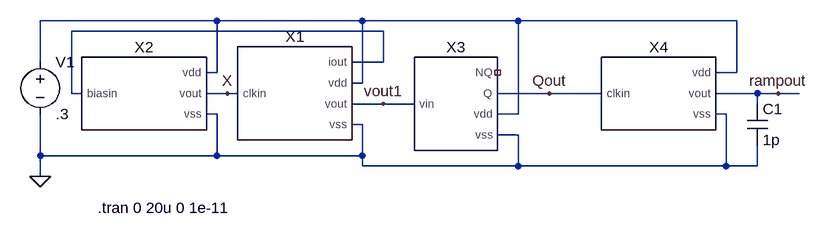
[diagram p0: schematic lowpowersystem1.asc]
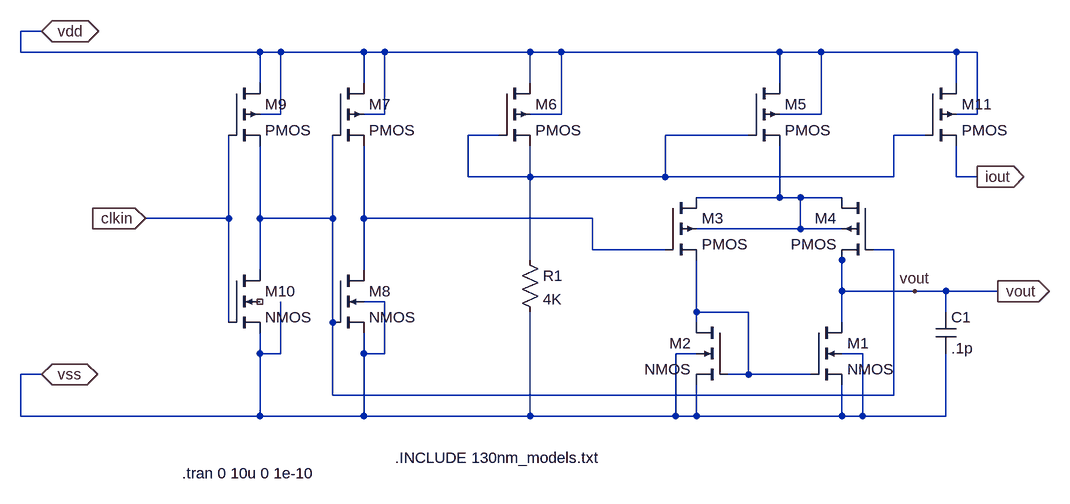
[diagram p1: sub-circuit currentsteeringrampgnerator3sym.asc]
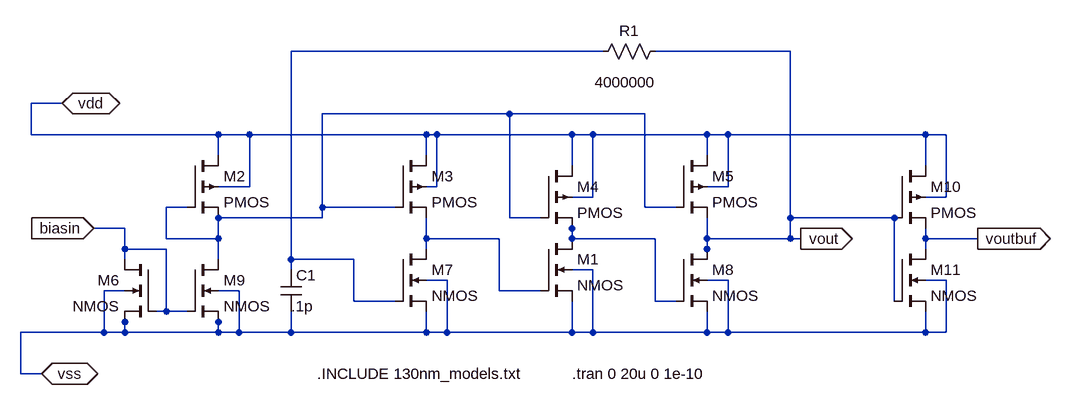
[diagram p2: sub-circuit lphysteresistoscillatorsym5.asc]
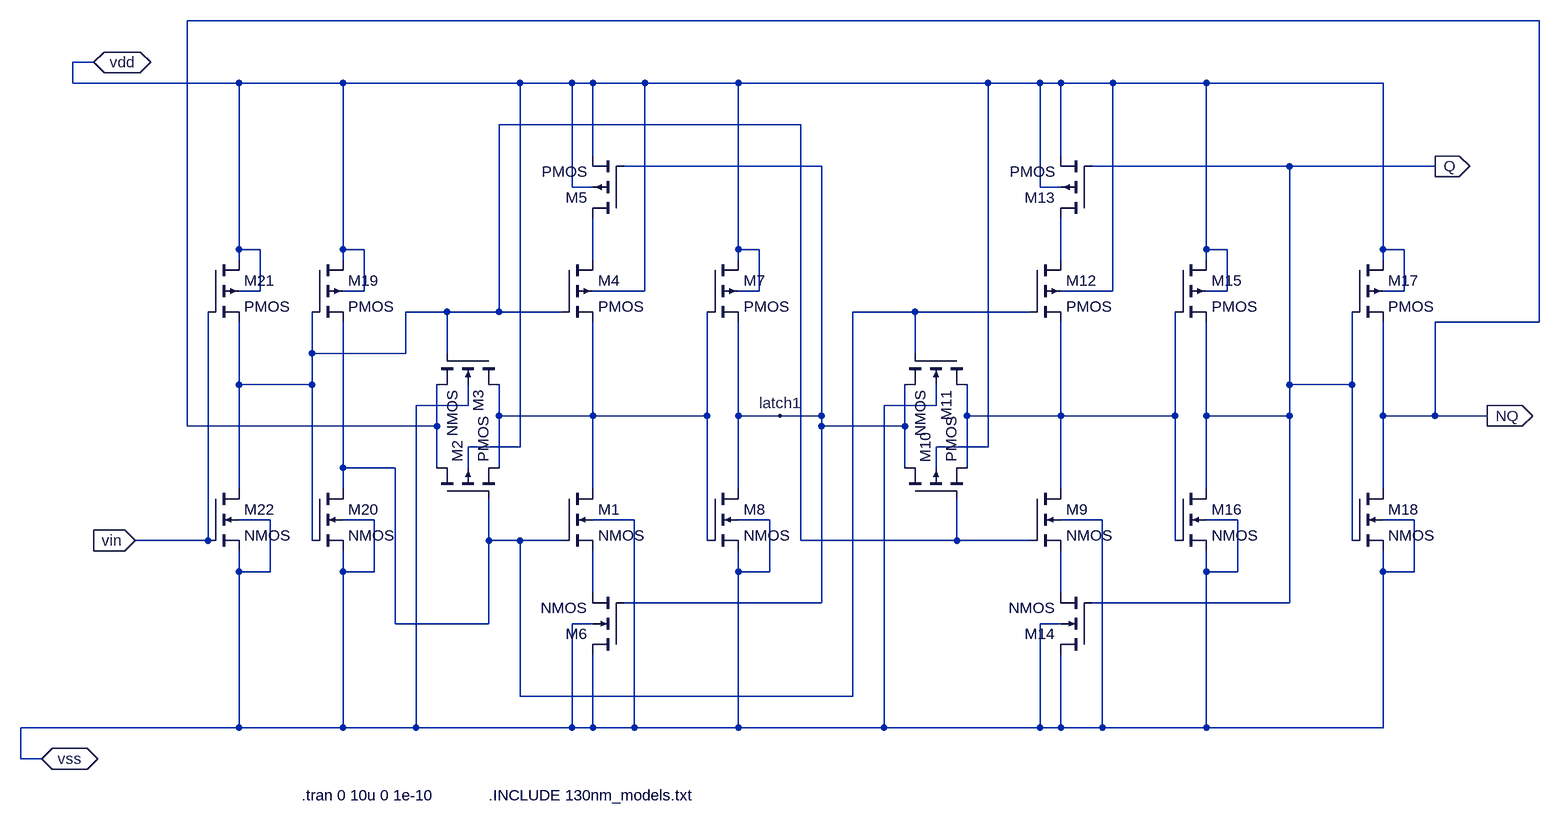
[diagram p3: sub-circuit lowpowerdflipflop2sym.asc]
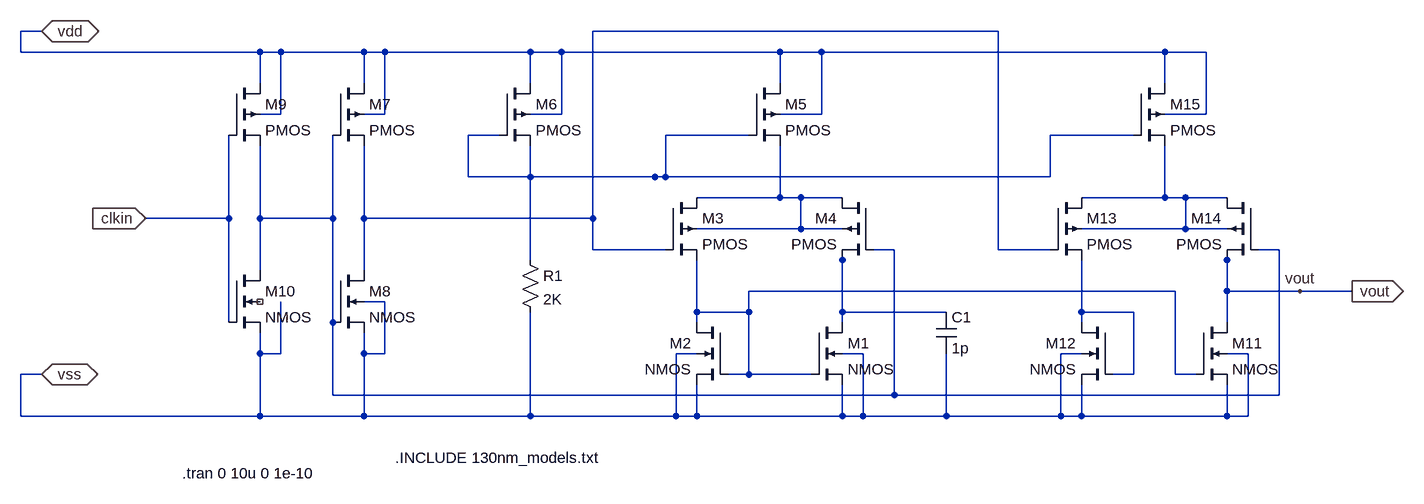
[diagram p4: sub-circuit currentsteeringrampgnerator3.asc]
lowpowersystem1.asc, the LTspice schematic file:
Version 4.1
SHEET 1 1044 680
WIRE 112 64 -160 64
WIRE 336 64 112 64
WIRE 576 64 336 64
WIRE 912 64 576 64
WIRE 368 80 -112 80
WIRE -160 128 -160 64
WIRE 368 128 368 80
WIRE 368 128 320 128
WIRE 112 144 112 64
WIRE 112 144 96 144
WIRE 912 144 912 64
WIRE 912 144 880 144
WIRE 336 160 336 64
WIRE 336 160 320 160
WIRE -112 176 -112 80
WIRE -96 176 -112 176
WIRE 128 176 96 176
WIRE 144 176 128 176
WIRE 624 176 544 176
WIRE 704 176 624 176
WIRE 944 176 880 176
WIRE 976 176 944 176
WIRE 1008 176 976 176
WIRE 368 192 320 192
WIRE 416 192 368 192
WIRE 944 192 944 176
WIRE 112 208 96 208
WIRE 576 208 576 64
WIRE 576 208 544 208
WIRE 896 208 880 208
WIRE 336 224 320 224
WIRE 576 240 544 240
WIRE -160 272 -160 208
WIRE 112 272 112 208
WIRE 112 272 -160 272
WIRE 336 272 336 224
WIRE 336 272 112 272
WIRE 336 288 336 272
WIRE 576 288 576 240
WIRE 576 288 336 288
WIRE 896 288 896 208
WIRE 896 288 576 288
WIRE 944 288 944 256
WIRE 944 288 896 288
WIRE -160 304 -160 272
FLAG 368 192 vout1
FLAG -160 304 0
FLAG 128 176 X
FLAG 624 176 Qout
FLAG 976 176 rampout
SYMBOL CurrentSteeringRampGnerator3sym 224 176 R0
SYMATTR InstName X1
SYMBOL lphysteresistoscillatorsym5 0 176 R0
SYMATTR InstName X2
SYMBOL voltage -160 112 R0
WINDOW 123 0 0 Left 0
WINDOW 39 0 0 Left 0
SYMATTR InstName V1
SYMATTR Value .3
SYMBOL lowpowerdflipflop2sym 480 192 R0
SYMATTR InstName X3
SYMBOL CurrentSteeringRampGnerator3 784 176 R0
SYMATTR InstName X4
SYMBOL cap 928 192 R0
SYMATTR InstName C1
SYMATTR Value 1p
TEXT -72 352 Left 2 !.tran 0 20u 0 1e-11

currentsteeringrampgnerator3sym.asc, the sub-circuit schematic file:
Version 4
SHEET 1 880 680
WIRE -944 -224 -976 -224
WIRE -976 -192 -976 -224
WIRE -608 -192 -976 -192
WIRE -576 -192 -608 -192
WIRE -448 -192 -576 -192
WIRE -416 -192 -448 -192
WIRE -192 -192 -416 -192
WIRE -144 -192 -192 -192
WIRE 192 -192 -144 -192
WIRE 256 -192 192 -192
WIRE 464 -192 256 -192
WIRE 496 -192 464 -192
WIRE -608 -144 -608 -192
WIRE -448 -144 -448 -192
WIRE -192 -144 -192 -192
WIRE 192 -144 192 -192
WIRE 464 -144 464 -192
WIRE -576 -96 -576 -192
WIRE -576 -96 -608 -96
WIRE -416 -96 -416 -192
WIRE -416 -96 -448 -96
WIRE -144 -96 -144 -192
WIRE -144 -96 -192 -96
WIRE 256 -96 256 -192
WIRE 256 -96 192 -96
WIRE 496 -96 496 -192
WIRE 496 -96 464 -96
WIRE -240 -64 -288 -64
WIRE 144 -64 16 -64
WIRE 416 -64 368 -64
WIRE -288 0 -288 -64
WIRE -192 0 -192 -48
WIRE -192 0 -288 0
WIRE 16 0 16 -64
WIRE 16 0 -192 0
WIRE 368 0 368 -64
WIRE 368 0 16 0
WIRE 464 0 464 -48
WIRE 496 0 464 0
WIRE 192 32 192 -48
WIRE 192 32 64 32
WIRE 224 32 192 32
WIRE 288 32 224 32
WIRE -656 64 -656 -64
WIRE -656 64 -784 64
WIRE -608 64 -608 -48
WIRE -496 64 -496 -64
WIRE -496 64 -608 64
WIRE -448 64 -448 -48
WIRE -96 64 -448 64
WIRE 224 80 224 32
WIRE 224 80 64 80
WIRE 288 80 224 80
WIRE -96 112 -96 64
WIRE 16 112 -96 112
WIRE 368 112 336 112
WIRE -192 128 -192 0
WIRE 288 128 288 112
WIRE -608 144 -608 64
WIRE -448 144 -448 64
WIRE 288 176 288 128
WIRE 400 176 288 176
WIRE 448 176 400 176
WIRE 528 176 448 176
WIRE -416 192 -448 192
WIRE 64 208 64 128
WIRE 144 208 64 208
WIRE 448 208 448 176
WIRE -656 224 -656 64
WIRE -496 224 -496 64
WIRE 64 224 64 208
WIRE 288 224 288 176
WIRE -608 272 -608 240
WIRE -576 272 -576 192
WIRE -576 272 -608 272
WIRE -448 272 -448 240
WIRE -416 272 -416 192
WIRE -416 272 -448 272
WIRE 64 272 32 272
WIRE 320 272 288 272
WIRE -944 304 -976 304
WIRE 144 304 144 208
WIRE 144 304 112 304
WIRE 240 304 144 304
WIRE -496 336 -496 224
WIRE 368 336 368 112
WIRE 368 336 -496 336
WIRE -976 368 -976 304
WIRE -608 368 -608 272
WIRE -608 368 -976 368
WIRE -448 368 -448 272
WIRE -448 368 -608 368
WIRE -192 368 -192 208
WIRE -192 368 -448 368
WIRE 32 368 32 272
WIRE 32 368 -192 368
WIRE 64 368 64 320
WIRE 64 368 32 368
WIRE 288 368 288 320
WIRE 288 368 64 368
WIRE 320 368 320 272
WIRE 320 368 288 368
WIRE 448 368 448 272
WIRE 448 368 320 368
FLAG 400 176 vout
FLAG 528 176 vout
IOPIN 528 176 Out
FLAG -944 -224 vdd
IOPIN -944 -224 BiDir
FLAG -944 304 vss
IOPIN -944 304 BiDir
FLAG -784 64 clkin
IOPIN -784 64 In
FLAG 496 0 iout
IOPIN 496 0 Out
SYMBOL nmos4 240 224 R0
SYMATTR InstName M1
SYMATTR Value2 l=1u w=20u
SYMBOL nmos4 112 224 M0
SYMATTR InstName M2
SYMATTR Value2 l=1u w=20u
SYMBOL pmos4 16 32 R0
SYMATTR InstName M3
SYMATTR Value2 l=1u w=20u
SYMBOL pmos4 336 32 M0
SYMATTR InstName M4
SYMATTR Value2 l=1u w=20u
SYMBOL pmos4 144 -144 R0
SYMATTR InstName M5
SYMATTR Value2 l=1u w=20u
SYMBOL pmos4 -240 -144 R0
SYMATTR InstName M6
SYMATTR Value2 l=1u w=10u
SYMBOL res -208 112 R0
SYMATTR InstName R1
SYMATTR Value 4K
SYMBOL pmos4 -496 -144 R0
SYMATTR InstName M7
SYMBOL nmos4 -496 144 R0
SYMATTR InstName M8
SYMBOL pmos4 -656 -144 R0
SYMATTR InstName M9
SYMATTR Value2 l=.2u w=2u
SYMBOL nmos4 -656 144 R0
SYMATTR InstName M10
SYMATTR Value2 l=.2u w=1u
SYMBOL cap 432 208 R0
SYMATTR InstName C1
SYMATTR Value .1p
SYMBOL pmos4 416 -144 R0
SYMATTR InstName M11
SYMATTR Value2 l=1u w=2u
TEXT -728 456 Left 2 !.tran 0 10u 0 1e-10
TEXT -400 432 Left 2 !.INCLUDE 130nm_models.txt

lphysteresistoscillatorsym5.asc, the sub-circuit schematic file:
Version 4
SHEET 1 932 680
WIRE 208 -64 -272 -64
WIRE 496 -64 288 -64
WIRE -624 16 -672 16
WIRE 64 32 -224 32
WIRE 272 32 64 32
WIRE -672 64 -672 16
WIRE -384 64 -672 64
WIRE -336 64 -384 64
WIRE -64 64 -336 64
WIRE -48 64 -64 64
WIRE 160 64 -48 64
WIRE 192 64 160 64
WIRE 368 64 192 64
WIRE 400 64 368 64
WIRE 704 64 400 64
WIRE 736 64 704 64
WIRE -384 96 -384 64
WIRE -64 96 -64 64
WIRE 368 96 368 64
WIRE 160 112 160 64
WIRE 704 112 704 64
WIRE -336 144 -336 64
WIRE -336 144 -384 144
WIRE -48 144 -48 64
WIRE -48 144 -64 144
WIRE 400 144 400 64
WIRE 400 144 368 144
WIRE 192 160 192 64
WIRE 192 160 160 160
WIRE 736 160 736 64
WIRE 736 160 704 160
WIRE -432 176 -464 176
WIRE -224 176 -224 32
WIRE -112 176 -224 176
WIRE 272 176 272 32
WIRE 320 176 272 176
WIRE -224 192 -224 176
WIRE -224 192 -384 192
WIRE 64 192 64 32
WIRE 112 192 64 192
WIRE 496 192 496 -64
WIRE 656 192 496 192
WIRE -528 208 -576 208
WIRE 160 208 160 192
WIRE -464 224 -464 176
WIRE -384 224 -384 192
WIRE -384 224 -464 224
WIRE -64 224 -64 192
WIRE 48 224 -64 224
WIRE 160 224 160 208
WIRE 288 224 160 224
WIRE 368 224 368 192
WIRE 496 224 496 192
WIRE 496 224 368 224
WIRE 512 224 496 224
WIRE 704 224 704 208
WIRE 784 224 704 224
WIRE -528 240 -528 208
WIRE -464 240 -528 240
WIRE -64 240 -64 224
WIRE 368 240 368 224
WIRE 704 240 704 224
WIRE -528 256 -528 240
WIRE -384 256 -384 224
WIRE -272 256 -272 -64
WIRE -176 256 -272 256
WIRE 368 256 368 240
WIRE -272 272 -272 256
WIRE 192 272 160 272
WIRE -32 288 -64 288
WIRE 400 288 368 288
WIRE 736 288 704 288
WIRE -528 304 -560 304
WIRE -352 304 -384 304
WIRE 48 304 48 224
WIRE 112 304 48 304
WIRE -176 320 -176 256
WIRE -112 320 -176 320
WIRE 288 320 288 224
WIRE 320 320 288 320
WIRE 656 320 656 192
WIRE -464 336 -464 240
WIRE -464 336 -480 336
WIRE -432 336 -464 336
WIRE -528 352 -528 336
WIRE -384 352 -384 336
WIRE -560 368 -560 304
WIRE -560 368 -688 368
WIRE -528 368 -528 352
WIRE -528 368 -560 368
WIRE -384 368 -384 352
WIRE -384 368 -528 368
WIRE -352 368 -352 304
WIRE -352 368 -384 368
WIRE -272 368 -272 336
WIRE -272 368 -352 368
WIRE -64 368 -64 336
WIRE -64 368 -272 368
WIRE -32 368 -32 288
WIRE -32 368 -64 368
WIRE 160 368 160 320
WIRE 160 368 -32 368
WIRE 192 368 192 272
WIRE 192 368 160 368
WIRE 368 368 368 336
WIRE 368 368 192 368
WIRE 400 368 400 288
WIRE 400 368 368 368
WIRE 704 368 704 336
WIRE 704 368 400 368
WIRE 736 368 736 288
WIRE 736 368 704 368
WIRE -688 432 -688 368
WIRE -656 432 -688 432
FLAG 512 224 vout
IOPIN 512 224 Out
FLAG -656 432 vss
IOPIN -656 432 BiDir
FLAG -624 16 vdd
IOPIN -624 16 BiDir
FLAG -576 208 biasin
IOPIN -576 208 In
FLAG 784 224 voutbuf
IOPIN 784 224 Out
SYMBOL nmos4 112 224 R0
SYMATTR InstName M1
SYMATTR Value2 l=1u w=10u
SYMBOL pmos4 -432 96 R0
SYMATTR InstName M2
SYMATTR Value2 l=1u w=10u
SYMBOL pmos4 -112 96 R0
SYMATTR InstName M3
SYMATTR Value2 l=1u w=10u
SYMBOL pmos4 112 112 R0
SYMATTR InstName M4
SYMATTR Value2 l=1u w=10u
SYMBOL pmos4 320 96 R0
SYMATTR InstName M5
SYMATTR Value2 l=1u w=200u
SYMBOL nmos4 -112 240 R0
SYMATTR InstName M7
SYMATTR Value2 l=.2u w=5u
SYMBOL nmos4 320 240 R0
SYMATTR InstName M8
SYMATTR Value2 l=.2u w=4u
SYMBOL cap -288 272 R0
WINDOW 3 16 56 Left 2
SYMATTR Value .1p
SYMATTR InstName C1
SYMBOL res 304 -80 R90
WINDOW 0 0 56 VBottom 2
WINDOW 3 48 62 VTop 2
SYMATTR InstName R1
SYMATTR Value 4000000
SYMBOL nmos4 -480 256 M0
SYMATTR InstName M6
SYMATTR Value2 l=.2u w=5u
SYMBOL nmos4 -432 256 R0
SYMATTR InstName M9
SYMATTR Value2 l=.2u w=2u
SYMBOL pmos4 656 112 R0
SYMATTR InstName M10
SYMATTR Value2 l=.2u w=2u
SYMBOL nmos4 656 240 R0
SYMATTR InstName M11
SYMATTR Value2 l=.2u w=1u
TEXT -232 432 Left 2 !.INCLUDE 130nm_models.txt
TEXT 160 432 Left 2 !.tran 0 20u 0 1e-10

lowpowerdflipflop2sym.asc, the sub-circuit schematic file:
Version 4
SHEET 1 1684 680
WIRE 1552 -624 -528 -624
WIRE -672 -560 -704 -560
WIRE -704 -528 -704 -560
WIRE -448 -528 -704 -528
WIRE -288 -528 -448 -528
WIRE -16 -528 -288 -528
WIRE 64 -528 -16 -528
WIRE 96 -528 64 -528
WIRE 176 -528 96 -528
WIRE 320 -528 176 -528
WIRE 704 -528 320 -528
WIRE 784 -528 704 -528
WIRE 816 -528 784 -528
WIRE 896 -528 816 -528
WIRE 1040 -528 896 -528
WIRE 1312 -528 1040 -528
WIRE 416 -464 -48 -464
WIRE 96 -416 96 -528
WIRE 816 -416 816 -528
WIRE 448 -400 144 -400
WIRE 1168 -400 864 -400
WIRE 1392 -400 1168 -400
WIRE 64 -368 64 -528
WIRE 96 -368 64 -368
WIRE 784 -368 784 -528
WIRE 816 -368 784 -368
WIRE -448 -272 -448 -528
WIRE -416 -272 -448 -272
WIRE -288 -272 -288 -528
WIRE -256 -272 -288 -272
WIRE 320 -272 320 -528
WIRE 352 -272 320 -272
WIRE 1040 -272 1040 -528
WIRE 1072 -272 1040 -272
WIRE 1312 -272 1312 -528
WIRE 1344 -272 1312 -272
WIRE -448 -256 -448 -272
WIRE -288 -256 -288 -272
WIRE 96 -256 96 -320
WIRE 320 -256 320 -272
WIRE 816 -256 816 -320
WIRE 1040 -256 1040 -272
WIRE 1312 -256 1312 -272
WIRE -416 -208 -416 -272
WIRE -416 -208 -448 -208
WIRE -256 -208 -256 -272
WIRE -256 -208 -288 -208
WIRE 176 -208 176 -528
WIRE 176 -208 96 -208
WIRE 352 -208 352 -272
WIRE 352 -208 320 -208
WIRE 896 -208 896 -528
WIRE 896 -208 816 -208
WIRE 1072 -208 1072 -272
WIRE 1072 -208 1040 -208
WIRE 1344 -208 1344 -272
WIRE 1344 -208 1312 -208
WIRE -128 -176 -192 -176
WIRE -48 -176 -48 -464
WIRE -48 -176 -128 -176
WIRE 48 -176 -48 -176
WIRE 592 -176 496 -176
WIRE 768 -176 592 -176
WIRE 1552 -160 1552 -624
WIRE 1552 -160 1392 -160
WIRE -336 -112 -336 -176
WIRE -192 -112 -192 -176
WIRE -192 -112 -336 -112
WIRE -128 -112 -128 -176
WIRE 592 -112 592 -176
WIRE -448 -64 -448 -160
WIRE -336 -64 -336 -112
WIRE -336 -64 -448 -64
WIRE 1168 -64 1168 -400
WIRE 1264 -64 1264 -176
WIRE 1264 -64 1168 -64
WIRE -96 -32 -96 -64
WIRE -96 -32 -176 -32
WIRE 624 -32 624 -64
WIRE 624 -32 544 -32
WIRE -48 -16 -48 -64
WIRE 96 -16 96 -160
WIRE 96 -16 -48 -16
WIRE 272 -16 272 -176
WIRE 272 -16 96 -16
WIRE 320 -16 320 -160
WIRE 384 -16 320 -16
WIRE 448 -16 448 -400
WIRE 448 -16 384 -16
WIRE 672 -16 672 -64
WIRE 816 -16 816 -160
WIRE 816 -16 672 -16
WIRE 992 -16 992 -176
WIRE 992 -16 816 -16
WIRE 1040 -16 1040 -160
WIRE 1168 -16 1168 -64
WIRE 1168 -16 1040 -16
WIRE 1312 -16 1312 -160
WIRE 1392 -16 1392 -160
WIRE 1392 -16 1312 -16
WIRE 1472 -16 1392 -16
WIRE -528 0 -528 -624
WIRE -144 0 -144 -64
WIRE -144 0 -528 0
WIRE 448 0 448 -16
WIRE 576 0 576 -64
WIRE 576 0 448 0
WIRE -16 32 -16 -528
WIRE -16 32 -96 32
WIRE 704 32 704 -528
WIRE 704 32 624 32
WIRE -288 64 -288 -160
WIRE -208 64 -288 64
WIRE -144 64 -144 0
WIRE -96 64 -96 32
WIRE -48 64 -48 -16
WIRE 576 64 576 0
WIRE 624 64 624 32
WIRE 672 64 672 -16
WIRE -448 96 -448 -64
WIRE -288 96 -288 64
WIRE 96 96 96 -16
WIRE 320 96 320 -16
WIRE 816 96 816 -16
WIRE 1040 96 1040 -16
WIRE 1312 96 1312 -16
WIRE -400 144 -448 144
WIRE -240 144 -288 144
WIRE 160 144 96 144
WIRE 368 144 320 144
WIRE 880 144 816 144
WIRE 1088 144 1040 144
WIRE 1360 144 1312 144
WIRE -496 176 -496 -176
WIRE -496 176 -608 176
WIRE -336 176 -336 -64
WIRE -64 176 -64 112
WIRE -16 176 -64 176
WIRE 48 176 -16 176
WIRE 272 176 272 -16
WIRE 416 176 416 -464
WIRE 656 176 656 112
WIRE 656 176 416 176
WIRE 768 176 656 176
WIRE 992 176 992 -16
WIRE 1264 176 1264 -64
WIRE -448 224 -448 192
WIRE -400 224 -400 144
WIRE -400 224 -448 224
WIRE -288 224 -288 192
WIRE -240 224 -240 144
WIRE -240 224 -288 224
WIRE 320 224 320 192
WIRE 368 224 368 144
WIRE 368 224 320 224
WIRE 1040 224 1040 192
WIRE 1088 224 1088 144
WIRE 1088 224 1040 224
WIRE 1312 224 1312 192
WIRE 1360 224 1360 144
WIRE 1360 224 1312 224
WIRE 96 256 96 192
WIRE 816 256 816 192
WIRE 448 272 448 0
WIRE 448 272 144 272
WIRE 1168 272 1168 -16
WIRE 1168 272 864 272
WIRE -208 304 -208 64
WIRE -64 304 -64 176
WIRE -64 304 -208 304
WIRE 96 304 64 304
WIRE 816 304 784 304
WIRE -16 416 -16 176
WIRE 496 416 496 -176
WIRE 496 416 -16 416
WIRE -448 464 -448 224
WIRE -448 464 -784 464
WIRE -288 464 -288 224
WIRE -288 464 -448 464
WIRE -176 464 -176 -32
WIRE -176 464 -288 464
WIRE 64 464 64 304
WIRE 64 464 -176 464
WIRE 96 464 96 352
WIRE 96 464 64 464
WIRE 160 464 160 144
WIRE 160 464 96 464
WIRE 320 464 320 224
WIRE 320 464 160 464
WIRE 544 464 544 -32
WIRE 544 464 320 464
WIRE 784 464 784 304
WIRE 784 464 544 464
WIRE 816 464 816 352
WIRE 816 464 784 464
WIRE 880 464 880 144
WIRE 880 464 816 464
WIRE 1040 464 1040 224
WIRE 1040 464 880 464
WIRE 1312 464 1312 224
WIRE 1312 464 1040 464
WIRE -784 512 -784 464
WIRE -752 512 -784 512
FLAG 384 -16 latch1
FLAG 1472 -16 NQ
IOPIN 1472 -16 Out
FLAG 1392 -400 Q
IOPIN 1392 -400 Out
FLAG -608 176 vin
IOPIN -608 176 In
FLAG -672 -560 vdd
IOPIN -672 -560 BiDir
FLAG -752 512 vss
IOPIN -752 512 BiDir
SYMBOL nmos4 48 96 R0
SYMATTR InstName M1
SYMATTR Value2 l=.2u w=1u
SYMBOL pmos4 -144 112 R270
SYMATTR InstName M2
SYMATTR Value2 l=.2u w=10u
SYMBOL nmos4 -48 -112 R90
SYMATTR InstName M3
SYMATTR Value2 l=.2u w=10u
SYMBOL pmos4 48 -256 R0
SYMATTR InstName M4
SYMATTR Value2 l=.2u w=4u
SYMBOL pmos4 144 -320 R180
SYMATTR InstName M5
SYMATTR Value2 l=.2u w=4u
SYMBOL nmos4 144 352 R180
SYMATTR InstName M6
SYMATTR Value2 l=.2u w=1u
SYMBOL pmos4 272 -256 R0
SYMATTR InstName M7
SYMATTR Value2 l=.2u w=2u
SYMBOL nmos4 272 96 R0
SYMATTR InstName M8
SYMATTR Value2 l=.2u w=1u
SYMBOL nmos4 768 96 R0
SYMATTR InstName M9
SYMATTR Value2 l=.2u w=1u
SYMBOL pmos4 576 112 R270
SYMATTR InstName M10
SYMATTR Value2 l=.2u w=10u
SYMBOL nmos4 672 -112 R90
SYMATTR InstName M11
SYMATTR Value2 l=.2u w=10u
SYMBOL pmos4 768 -256 R0
SYMATTR InstName M12
SYMATTR Value2 l=.2u w=4u
SYMBOL pmos4 864 -320 R180
SYMATTR InstName M13
SYMATTR Value2 l=.2u w=4u
SYMBOL nmos4 864 352 R180
SYMATTR InstName M14
SYMATTR Value2 l=.2u w=1u
SYMBOL pmos4 992 -256 R0
SYMATTR InstName M15
SYMATTR Value2 l=.2u w=2u
SYMBOL nmos4 992 96 R0
SYMATTR InstName M16
SYMATTR Value2 l=.2u w=1u
SYMBOL pmos4 1264 -256 R0
SYMATTR InstName M17
SYMATTR Value2 l=.2u w=2u
SYMBOL nmos4 1264 96 R0
SYMATTR InstName M18
SYMATTR Value2 l=.2u w=1u
SYMBOL pmos4 -336 -256 R0
SYMATTR InstName M19
SYMATTR Value2 l=.2u w=2u
SYMBOL nmos4 -336 96 R0
SYMATTR InstName M20
SYMATTR Value2 l=.2u w=1u
SYMBOL pmos4 -496 -256 R0
SYMATTR InstName M21
SYMATTR Value2 l=.2u w=2u
SYMBOL nmos4 -496 96 R0
SYMATTR InstName M22
SYMATTR Value2 l=.2u w=1u
TEXT -352 568 Left 2 !.tran 0 10u 0 1e-10
TEXT -64 568 Left 2 !.INCLUDE 130nm_models.txt

currentsteeringrampgnerator3.asc, the sub-circuit schematic file:
Version 4
SHEET 1 1184 680
WIRE -944 -224 -976 -224
WIRE 528 -224 -96 -224
WIRE -976 -192 -976 -224
WIRE -608 -192 -976 -192
WIRE -576 -192 -608 -192
WIRE -448 -192 -576 -192
WIRE -416 -192 -448 -192
WIRE -192 -192 -416 -192
WIRE -144 -192 -192 -192
WIRE 192 -192 -144 -192
WIRE 256 -192 192 -192
WIRE 784 -192 256 -192
WIRE 848 -192 784 -192
WIRE -608 -144 -608 -192
WIRE -448 -144 -448 -192
WIRE -192 -144 -192 -192
WIRE 192 -144 192 -192
WIRE 784 -144 784 -192
WIRE -576 -96 -576 -192
WIRE -576 -96 -608 -96
WIRE -416 -96 -416 -192
WIRE -416 -96 -448 -96
WIRE -144 -96 -144 -192
WIRE -144 -96 -192 -96
WIRE 256 -96 256 -192
WIRE 256 -96 192 -96
WIRE 848 -96 848 -192
WIRE 848 -96 784 -96
WIRE -240 -64 -288 -64
WIRE 144 -64 16 -64
WIRE 736 -64 608 -64
WIRE -288 0 -288 -64
WIRE -192 0 -192 -48
WIRE -192 0 -288 0
WIRE 16 0 16 -64
WIRE 16 0 -192 0
WIRE 608 0 608 -64
WIRE 608 0 16 0
WIRE 192 32 192 -48
WIRE 192 32 64 32
WIRE 224 32 192 32
WIRE 288 32 224 32
WIRE 784 32 784 -48
WIRE 784 32 656 32
WIRE 816 32 784 32
WIRE 880 32 816 32
WIRE -656 64 -656 -64
WIRE -656 64 -784 64
WIRE -608 64 -608 -48
WIRE -496 64 -496 -64
WIRE -496 64 -608 64
WIRE -448 64 -448 -48
WIRE -96 64 -96 -224
WIRE -96 64 -448 64
WIRE 224 80 224 32
WIRE 224 80 64 80
WIRE 288 80 224 80
WIRE 816 80 816 32
WIRE 816 80 656 80
WIRE 880 80 816 80
WIRE -96 112 -96 64
WIRE 16 112 -96 112
WIRE 368 112 336 112
WIRE 528 112 528 -224
WIRE 608 112 528 112
WIRE 960 112 928 112
WIRE -192 128 -192 0
WIRE 288 128 288 112
WIRE 880 128 880 112
WIRE -608 144 -608 64
WIRE -448 144 -448 64
WIRE 800 176 144 176
WIRE 880 176 880 128
WIRE 992 176 880 176
WIRE 1072 176 992 176
WIRE -416 192 -448 192
WIRE 64 208 64 128
WIRE 144 208 144 176
WIRE 144 208 64 208
WIRE 288 208 288 128
WIRE 448 208 288 208
WIRE 656 208 656 128
WIRE 736 208 656 208
WIRE -656 224 -656 64
WIRE -496 224 -496 64
WIRE 64 224 64 208
WIRE 288 224 288 208
WIRE 656 224 656 208
WIRE 880 224 880 176
WIRE -608 272 -608 240
WIRE -576 272 -576 192
WIRE -576 272 -608 272
WIRE -448 272 -448 240
WIRE -416 272 -416 192
WIRE -416 272 -448 272
WIRE 64 272 32 272
WIRE 320 272 288 272
WIRE 656 272 624 272
WIRE 912 272 880 272
WIRE -944 304 -976 304
WIRE 144 304 144 208
WIRE 144 304 112 304
WIRE 240 304 144 304
WIRE 736 304 736 208
WIRE 736 304 704 304
WIRE 800 304 800 176
WIRE 832 304 800 304
WIRE -496 336 -496 224
WIRE 368 336 368 112
WIRE 368 336 -496 336
WIRE 960 336 960 112
WIRE 960 336 368 336
WIRE -976 368 -976 304
WIRE -608 368 -608 272
WIRE -608 368 -976 368
WIRE -448 368 -448 272
WIRE -448 368 -608 368
WIRE -192 368 -192 208
WIRE -192 368 -448 368
WIRE 32 368 32 272
WIRE 32 368 -192 368
WIRE 64 368 64 320
WIRE 64 368 32 368
WIRE 288 368 288 320
WIRE 288 368 64 368
WIRE 320 368 320 272
WIRE 320 368 288 368
WIRE 448 368 448 272
WIRE 448 368 320 368
WIRE 624 368 624 272
WIRE 624 368 448 368
WIRE 656 368 656 320
WIRE 656 368 624 368
WIRE 880 368 880 320
WIRE 880 368 656 368
WIRE 912 368 912 272
WIRE 912 368 880 368
WIRE 0 0 0 0
FLAG -944 -224 vdd
IOPIN -944 -224 BiDir
FLAG -944 304 vss
IOPIN -944 304 BiDir
FLAG -784 64 clkin
IOPIN -784 64 In
FLAG 992 176 vout
FLAG 1072 176 vout
IOPIN 1072 176 Out
SYMBOL nmos4 240 224 R0
SYMATTR InstName M1
SYMATTR Value2 l=1u w=20u
SYMBOL nmos4 112 224 M0
SYMATTR InstName M2
SYMATTR Value2 l=1u w=20u
SYMBOL pmos4 16 32 R0
SYMATTR InstName M3
SYMATTR Value2 l=1u w=20u
SYMBOL pmos4 336 32 M0
SYMATTR InstName M4
SYMATTR Value2 l=1u w=20u
SYMBOL pmos4 144 -144 R0
SYMATTR InstName M5
SYMATTR Value2 l=1u w=20u
SYMBOL pmos4 -240 -144 R0
SYMATTR InstName M6
SYMATTR Value2 l=1u w=10u
SYMBOL res -208 112 R0
SYMATTR InstName R1
SYMATTR Value 2K
SYMBOL pmos4 -496 -144 R0
SYMATTR InstName M7
SYMBOL nmos4 -496 144 R0
SYMATTR InstName M8
SYMBOL pmos4 -656 -144 R0
SYMATTR InstName M9
SYMATTR Value2 l=.2u w=2u
SYMBOL nmos4 -656 144 R0
SYMATTR InstName M10
SYMATTR Value2 l=.2u w=1u
SYMBOL cap 432 208 R0
SYMATTR InstName C1
SYMATTR Value 1p
SYMBOL nmos4 832 224 R0
SYMATTR InstName M11
SYMATTR Value2 l=1u w=20u
SYMBOL nmos4 704 224 M0
SYMATTR InstName M12
SYMATTR Value2 l=1u w=20u
SYMBOL pmos4 608 32 R0
SYMATTR InstName M13
SYMATTR Value2 l=1u w=20u
SYMBOL pmos4 928 32 M0
SYMATTR InstName M14
SYMATTR Value2 l=1u w=20u
SYMBOL pmos4 736 -144 R0
SYMATTR InstName M15
SYMATTR Value2 l=1u w=20u
TEXT -728 456 Left 2 !.tran 0 10u 0 1e-10
TEXT -400 432 Left 2 !.INCLUDE 130nm_models.txt

The netlist it stands for:
* lowpowersystem1.asc
X§X1 X N002 N001 vout1 0 currentsteeringrampgnerator3sym
X§X2 N002 N001 X 0 lphysteresistoscillatorsym5
V1 N001 0 .3
X§X3 vout1 NC_01 Qout N001 0 lowpowerdflipflop2sym
X§X4 Qout N001 rampout 0 currentsteeringrampgnerator3
C1 rampout 0 1p

* block symbol definitions
.subckt currentsteeringrampgnerator3sym clkin iout vdd vout vss
M1 vout N005 vss vss NMOS l=1u w=20u
M2 N005 N005 vss vss NMOS l=1u w=20u
M3 N002 N004 N005 N002 PMOS l=1u w=20u
M4 N002 N003 vout N002 PMOS l=1u w=20u
M5 vdd N001 N002 vdd PMOS l=1u w=20u
M6 vdd N001 N001 vdd PMOS l=1u w=10u
R1 N001 vss 4K
M7 vdd N003 N004 vdd PMOS
M8 N004 N003 vss vss NMOS
M9 vdd clkin N003 vdd PMOS l=.2u w=2u
M10 N003 clkin vss NC_01 NMOS l=.2u w=1u
C1 vout vss .1p
M11 vdd N001 iout vdd PMOS l=1u w=2u
.tran 0 10u 0 1e-10
.INCLUDE 130nm_models.txt
.ends currentsteeringrampgnerator3sym

.subckt lphysteresistoscillatorsym5 biasin vdd vout vss
M1 N003 N004 vss vss NMOS l=1u w=10u
M2 vdd N002 N002 vdd PMOS l=1u w=10u
M3 vdd N002 N004 vdd PMOS l=1u w=10u
M4 vdd N002 N003 vdd PMOS l=1u w=10u
M5 vdd N002 vout vdd PMOS l=1u w=200u
M7 N004 N001 vss vss NMOS l=.2u w=5u
M8 vout N003 vss vss NMOS l=.2u w=4u
C1 N001 vss .1p
R1 vout N001 4000000
M6 biasin biasin vss vss NMOS l=.2u w=5u
M9 N002 biasin vss vss NMOS l=.2u w=2u
M10 vdd vout voutbuf vdd PMOS l=.2u w=2u
M11 voutbuf vout vss vss NMOS l=.2u w=1u
.INCLUDE 130nm_models.txt
.tran 0 20u 0 1e-10
.ends lphysteresistoscillatorsym5

.subckt lowpowerdflipflop2sym vin NQ Q vdd vss
M1 N005 N004 N007 vss NMOS l=.2u w=1u
M2 NQ N004 N005 vdd PMOS l=.2u w=10u
M3 N005 N001 NQ vss NMOS l=.2u w=10u
M4 N002 N001 N005 vdd PMOS l=.2u w=4u
M5 N002 latch1 vdd vdd PMOS l=.2u w=4u
M6 vss latch1 N007 vss NMOS l=.2u w=1u
M7 vdd N005 latch1 vdd PMOS l=.2u w=2u
M8 latch1 N005 vss vss NMOS l=.2u w=1u
M9 N006 N001 N008 vss NMOS l=.2u w=1u
M10 latch1 N001 N006 vdd PMOS l=.2u w=10u
M11 N006 N004 latch1 vss NMOS l=.2u w=10u
M12 N003 N004 N006 vdd PMOS l=.2u w=4u
M13 N003 Q vdd vdd PMOS l=.2u w=4u
M14 vss Q N008 vss NMOS l=.2u w=1u
M15 vdd N006 Q vdd PMOS l=.2u w=2u
M16 Q N006 vss vss NMOS l=.2u w=1u
M17 vdd Q NQ vdd PMOS l=.2u w=2u
M18 NQ Q vss vss NMOS l=.2u w=1u
M19 vdd N001 N004 vdd PMOS l=.2u w=2u
M20 N004 N001 vss vss NMOS l=.2u w=1u
M21 vdd vin N001 vdd PMOS l=.2u w=2u
M22 N001 vin vss vss NMOS l=.2u w=1u
.tran 0 10u 0 1e-10
.INCLUDE 130nm_models.txt
.ends lowpowerdflipflop2sym

.subckt currentsteeringrampgnerator3 clkin vdd vout vss
M1 N006 N007 vss vss NMOS l=1u w=20u
M2 N007 N007 vss vss NMOS l=1u w=20u
M3 N003 N001 N007 N003 PMOS l=1u w=20u
M4 N003 N005 N006 N003 PMOS l=1u w=20u
M5 vdd N002 N003 vdd PMOS l=1u w=20u
M6 vdd N002 N002 vdd PMOS l=1u w=10u
R1 N002 vss 2K
M7 vdd N005 N001 vdd PMOS
M8 N001 N005 vss vss NMOS
M9 vdd clkin N005 vdd PMOS l=.2u w=2u
M10 N005 clkin vss NC_01 NMOS l=.2u w=1u
C1 N006 vss 1p
M11 vout N007 vss vss NMOS l=1u w=20u
M12 N008 N008 vss vss NMOS l=1u w=20u
M13 N004 N001 N008 N004 PMOS l=1u w=20u
M14 N004 N005 vout N004 PMOS l=1u w=20u
M15 vdd N002 N004 vdd PMOS l=1u w=20u
.tran 0 10u 0 1e-10
.INCLUDE 130nm_models.txt
.ends currentsteeringrampgnerator3

.model NMOS NMOS
.model PMOS PMOS
.lib standard.mos
.tran 0 20u 0 1e-11
.backanno
.end

* Results of the author's LTspice run, read from the files saved beside the schematic
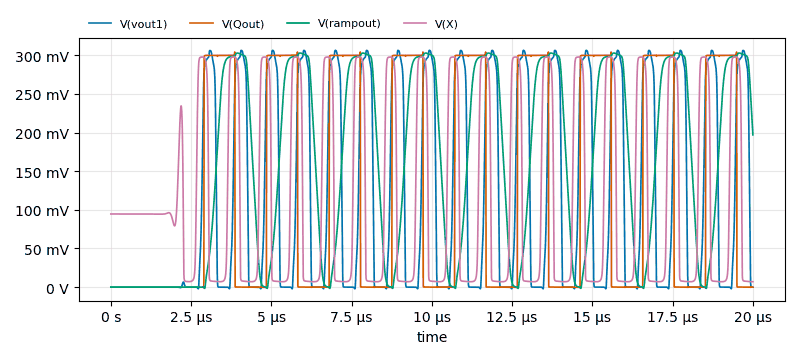
[diagram p5: Transient Analysis of lowpowersystem1.asc, plotted from the saved traces]
* Transient Analysis, 1 run:
*   V(vout1): min -2.176 mV, max 306.4 mV, average 118.3 mV, rms 178.8 mV, last 14.62 µV
*   V(Qout): min -1.092 mV, max 304.4 mV, average 130.9 mV, rms 197.9 mV, last 14.62 µV
*   V(rampout): min -1.67 mV, max 303 mV, average 157.3 mV, rms 201.8 mV, last 197.1 mV
*   V(X): min 6.975 mV, max 297.9 mV, average 113.3 mV, rms 166.8 mV, last 6.975 mV